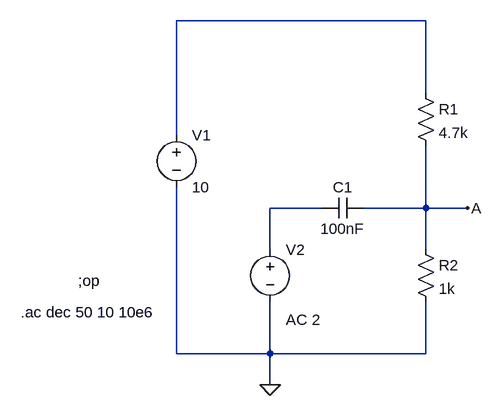
[diagram p0: schematic Draft2.asc]
Draft2.asc, the LTspice schematic file:
Version 4
SHEET 1 880 680
WIRE 544 -96 160 -96
WIRE 544 16 544 -96
WIRE 160 80 160 -96
WIRE 384 192 304 192
WIRE 544 192 544 96
WIRE 544 192 448 192
WIRE 608 192 544 192
WIRE 304 256 304 192
WIRE 544 256 544 192
WIRE 160 416 160 160
WIRE 304 416 304 336
WIRE 304 416 160 416
WIRE 544 416 544 336
WIRE 544 416 304 416
WIRE 304 464 304 416
FLAG 304 464 0
FLAG 608 192 A
SYMBOL voltage 160 64 R0
WINDOW 123 0 0 Left 0
WINDOW 39 0 0 Left 0
SYMATTR InstName V1
SYMATTR Value 10
SYMBOL res 528 0 R0
SYMATTR InstName R1
SYMATTR Value 4.7k
SYMBOL res 528 240 R0
SYMATTR InstName R2
SYMATTR Value 1k
SYMBOL cap 448 176 R90
WINDOW 0 0 32 VBottom 2
WINDOW 3 32 32 VTop 2
SYMATTR InstName C1
SYMATTR Value 100nF
SYMBOL voltage 304 240 R0
WINDOW 123 24 124 Left 2
WINDOW 39 0 0 Left 0
SYMATTR InstName V2
SYMATTR Value ""
SYMATTR Value2 AC 2
TEXT 8 304 Left 2 !;op
TEXT -80 352 Left 2 !.ac dec 50 10 10e6

The netlist it stands for:
* Draft2.asc
V1 N001 0 10
R1 N001 A 4.7k
R2 A 0 1k
C1 A N002 100nF
V2 N002 0 AC 2
;op
.ac dec 50 10 10e6
.backanno
.end